# EasyEDA Pro project ProPrj_四轴3.0_2025-12-06.epro, board PCB1
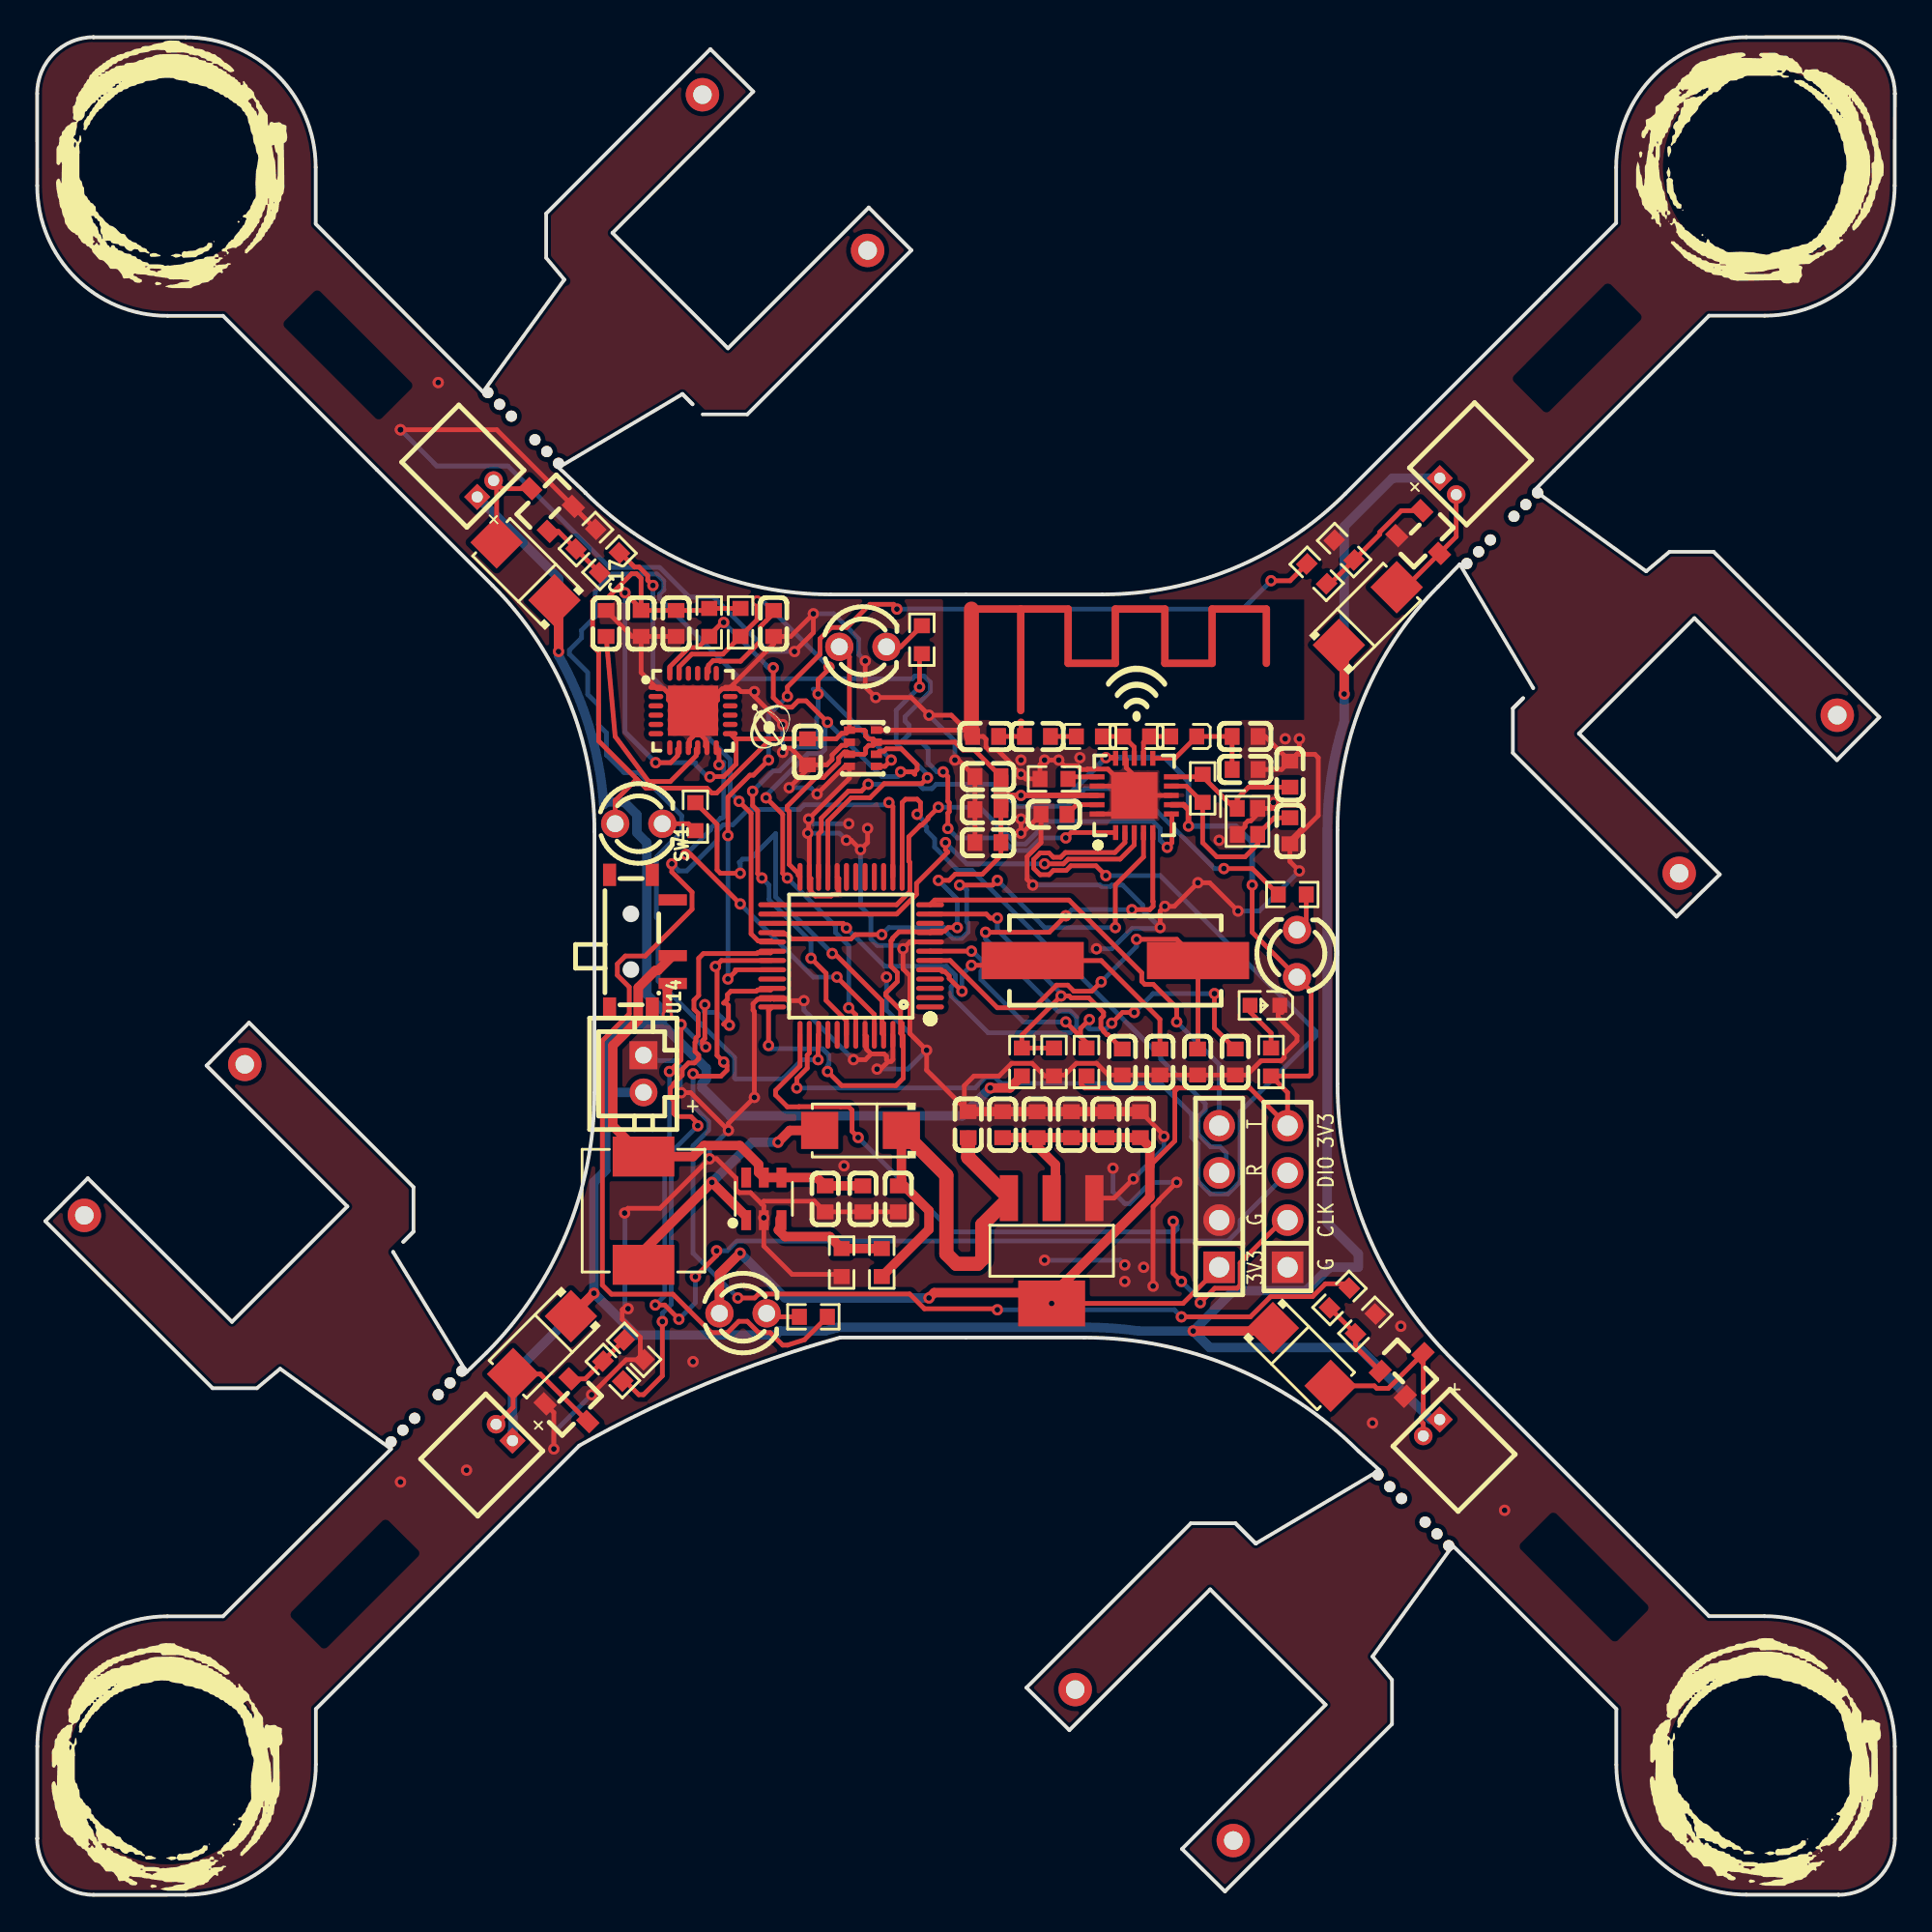
[diagram p14: board, top side]
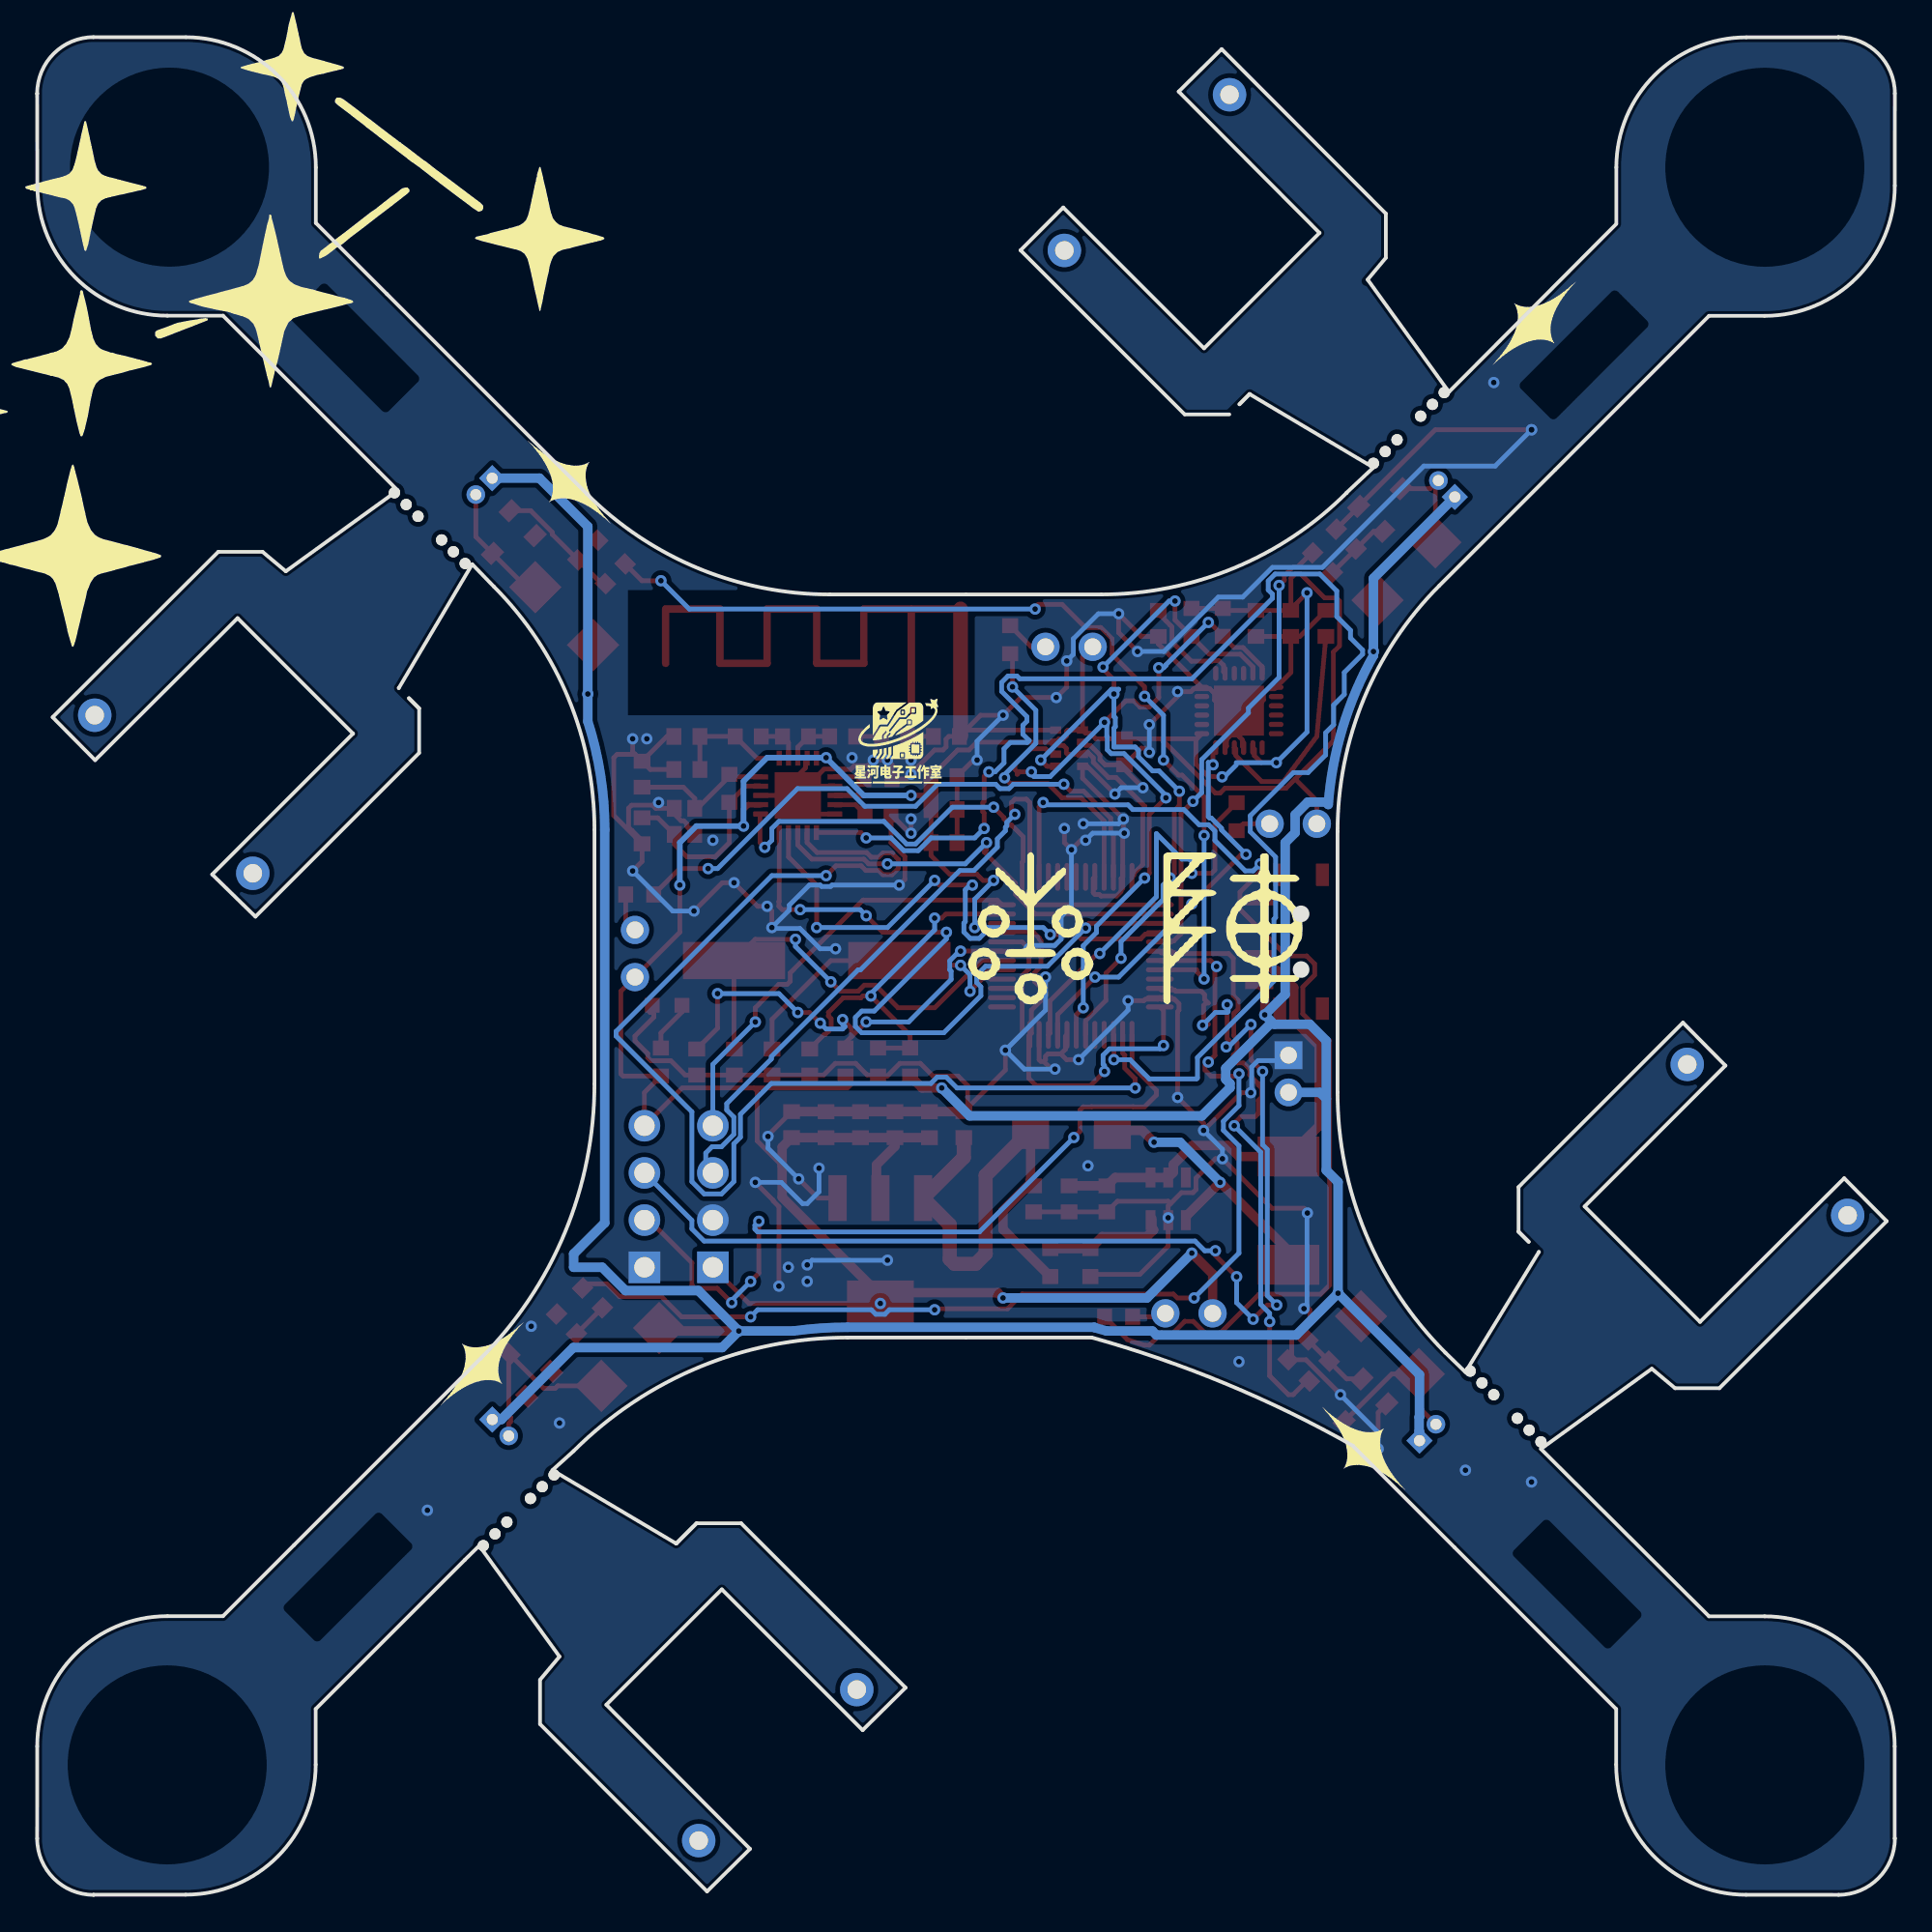
[diagram p15: board, bottom side, seen from below]

Outline 100 x 100 mm; copper layers: Top Layer, Bottom Layer. Coordinates in mm from the lower left corner of the outline.
Outline path: 0,3.04 0,3.04 arc(0.89,0.89) 3.04,0 8,0 arc(12.95,2.05) 15,7.01 15,10 23.71,18.71 29.18,24.19 arc(36.03,27.52) 43.22,30 56.37,30 arc(64.35,28.41) 71.12,23.89 72.26,22.86 65.6,18.91 ; 0.01,3.04 0.01,7.99 arc(2.06,12.94) 7.01,14.99 10,14.99 19.05,24 13.08,28.32 11.83,27.27 9.45,27.27 0.44,36.26 2.73,38.58 10.49,30.84 16.7,37.06 9.12,44.64 11.41,46.95 20.26,38.1 20.26,35.7 ; 3.04,100 3.04,100 arc(0.89,99.11) 0,96.96 0,92 arc(2.05,87.05) 7.01,85 10,85 18.29,76.71 24.52,70.48 arc(28.58,64.41) 30,57.24 30,43.2 arc(28.49,35.62) 24.19,29.18 23.11,28.14 19.16,34.61 19.16,34.6 ; 3.04,99.99 7.99,99.99 arc(12.94,97.94) 14.99,92.99 14.99,90 ; 14.99,89.94 24,80.9 28.38,86.95 27.4,88.12 27.4,90.5 36.24,99.36 38.55,97.07 30.97,89.46 37.18,83.25 44.77,90.83 47.06,88.53 38.23,79.69 35.83,79.69 ; 20.26,35.7 19.71,35.15 20.26,35.7 ; 34.72,80.79 34.73,80.79 ; 34.73,80.79 28.07,76.83 29.51,75.48 29.51,75.47 arc(35.57,71.42) 42.72,70 57.33,70 arc(64.42,71.41) 70.43,75.42 85,90 85,92.99 arc(87.05,97.95) 92,100 96.96,100 arc(99.11,99.11) 100,96.96 ; 34.73,80.79 35.28,80.24 34.73,80.79 ; 64.5,20 62.1,20 53.25,11.15 55.56,8.87 63.15,16.45 69.36,10.23 61.63,2.47 63.94,0.19 72.93,9.19 72.93,11.57 71.88,12.83 76.2,18.8 76.98,18.03 85.01,10 85.01,7.01 arc(87.06,2.06) 92.01,0.01 96.96,0.01 ; 64.5,20 65.6,18.91 ; 64.5,20 65.6,18.91 ; 65.6,18.91 65.61,18.91 ; 79.44,63.87 79.44,61.47 88.25,52.66 90.58,54.93 83,62.51 89.21,68.73 96.88,61.08 99.17,63.39 90.25,72.3 87.87,72.3 86.61,71.25 80.59,75.6 81.65,76.66 90,85.01 92.99,85.01 arc(97.94,87.06) 99.99,92.01 100,96.96 ; 79.44,63.87 79.99,64.41 79.44,63.87 ; 80.53,64.97 80.53,64.96 76.58,71.63 75.42,70.43 arc(71.41,64.42) 70,57.34 70,43.65 arc(71.59,35.66) 76.12,28.88 90,15 92.99,15 arc(97.95,12.95) 100,8 100,3.04 arc(99.11,0.89) 96.96,0 96.96,0 ; 100,96.96 100,96.96
Stack: Top Layer 0.035mm / Dielectric1 1.51mm FR4 er 4.5 / Bottom Layer 0.035mm

## Design rules (mm)
template: 自定义配置
spacing copperThickness1oz (default): track to track 0.102, other pairs 0.152 to 0.3
spacing copperThickness2oz: track to track 0.203, other pairs 0.152 to 0.3
track width copperThickness1oz (default): min 0.127, default 0.254, max 2.54
track width copperThickness2oz: min 0.203, default 0.254, max 2.54
differential pair differentialPair (default): width min 0.127, default 0.254, max 2.54; gap min 0.152, default 0.152
via viaSize (default): diameter min 0.5, default 0.61, max 10; hole min 0.3, default 0.305, max 6.3

## Placement (name value [footprint] x y rotation side)
C1  20pF  [C0603]  60.44 44.83 90 top
C2  100nF  [C0603]  51.97 41.46 270 top
C3  100nF  [C0603]  53.82 41.46 270 top
C4  100nF  [C0603]  55.68 41.46 270 top
C5  100nF  [C0603]  57.53 41.46 270 top
C6  10uF  [C0603]  46.36 37.47 90 top
C7  20pF  [C0603]  62.47 44.83 90 top
C8  10uF  [C0603]  42.42 37.47 90 top
C9  100nF  [C0603]  44.45 37.47 90 top
C10  100nF  [C0603]  64.49 44.83 90 top
C11  100nF  [C0603]  58.41 44.83 270 top
C12  10uF  [C0603]  50.12 41.46 90 top
C13  10uF  [C0603]  59.39 41.46 90 top
C14  2.2nF  [C0603]  39.64 68.44 90 top
C15  100nF  [C0603]  32.51 68.44 270 top
C16  10nF  [C0603]  34.39 68.44 90 top
C17  100nF  [C0603]  30.63 68.44 270 top
C35  100nF  [C0603]  41.47 61.53 90 top
C36  22pF  [C0603]  67.44 57.28 90 top
C37  22pF  [C0603]  67.44 60.33 270 top
C38  1.5pF  [C0603]  53.85 62.36 180 top
C39  1pF  [C0603]  51.05 62.36 0 top
C40  33nF  [C0603]  54.74 58.17 180 top
C41  100nF  [C0603]  51.18 58.42 0 top
C42  100nF  [C0603]  51.18 56.64 0 top
C43  1uF  [C0603]  51.18 60.2 0 top
C44  2.2nF  [C0603]  65.02 60.58 180 top
C45  4.7pF  [C0603]  65.02 62.36 180 top
CN2  1.25T-2AW  [CONN-TH_1.25T-2AW]  24.13 75.69 45 top
CN3  1.25T-2AW  [CONN-TH_1.25T-2AW]  25.15 24.89 135 top
CN4  1.25T-2AW  [CONN-TH_1.25T-2AW]  75.06 25.15 225 top
CN5  1.25T-2AW  [CONN-TH_1.25T-2AW]  75.95 75.82 315 top
D1  SS34  [SMA_L4.3-W2.6-LS5.2-RD]  44.32 41.15 180 top
D2  SS24  [SMA_L4.3-W2.6-LS5.2-RD]  26.29 71.25 135 top
D3  SS24  [SMA_L4.3-W2.6-LS5.2-RD]  27.18 29.59 225 top
D4  SS24  [SMA_L4.3-W2.6-LS5.2-RD]  68.07 28.96 315 top
D5  SS24  [SMA_L4.3-W2.6-LS5.2-RD]  71.63 68.83 45 top
H1  B-2100S04P-A110  [HDR-TH_4P-P2.54-V-M]  67.31 37.59 90 top
H2  B-2200S04P-A120  [HDR-TH_4P-P2.54-V-F]  63.63 37.59 90 top
L1  22uH  [IND-SMD_L7.1-W6.6]  32.64 36.83 270 top
L3  3.9nH  [L0603]  56.64 62.36 180 top
L4  8.2nH  [L0603]  59.18 62.36 0 top
L5  2.7nH  [L0603]  61.72 62.36 0 top
LED2  204-10SURD/S530-A3-L  [LED-TH_BD3.0-P2.54-FD]  38 31.3 0 top
LED3  204-10SURD/S530-A3-L  [LED-TH_BD3.0-P2.54-FD]  44.45 67.18 0 top
LED4  204-10SURD/S530-A3-L  [LED-TH_BD3.0-P2.54-FD]  67.82 50.67 90 top
LED5  204-10SURD/S530-A3-L  [LED-TH_BD3.0-P2.54-FD]  32.39 57.66 0 top
LED6  -  [LED_0603]  66.04 47.88 180 top
NOREF  -  [Pad_e2572]  88.39 54.99 135 top
NOREF#2  -  [Pad_e3071]  19.05 24.38 45 top
NOREF#3  -  [Pad_e3077]  76.96 71.67 45 top
NOREF#4  -  [Pad_e3079]  78.23 72.94 45 top
NOREF#5  -  [Pad_e2586]  2.54 36.58 135 top
NOREF#6  -  [Pad_e2895]  26.8 78.33 315 top
NOREF#7  -  [Pad_e2894]  25.53 79.6 315 top
NOREF#8  -  [Pad_e2882]  73.45 21.34 315 top
NOREF#9  -  [Pad_e3076]  22.86 28.19 45 top
NOREF#10  -  [Pad_e2897]  28.07 77.06 315 top
NOREF#11  -  [Pad_e3072]  19.69 25.02 45 top
NOREF#12  -  [Pad_e2883]  74.72 20.07 315 top
NOREF#13  -  [Pad_e3074]  21.59 26.92 45 top
NOREF#14  -  [Pad_e3081]  80.13 74.84 45 top
NOREF#15  -  [Pad_e2896]  27.43 77.69 315 top
NOREF#16  -  [Pad_e2893]  24.89 80.23 315 top
NOREF#17  -  [Pad_e2885]  75.99 18.8 315 top
NOREF#18  -  [Pad_e2584]  35.81 96.9 135 top
NOREF#19  -  [Pad_e2881]  72.81 21.97 315 top
NOREF#20  -  [Pad_e2583]  44.7 88.52 135 top
NOREF#21  -  [Pad_e2892]  24.26 80.87 315 top
NOREF#22  -  [Pad_e3080]  79.5 74.21 45 top
NOREF#23  -  [Pad_e2582]  96.9 63.5 135 top
NOREF#24  -  [Pad_e2587]  55.88 11.05 135 top
NOREF#25  -  [Pad_e2884]  75.35 19.43 315 top
NOREF#26  -  [Pad_e3082]  80.77 75.48 45 top
NOREF#27  -  [Pad_e2588]  64.39 2.92 135 top
NOREF#28  -  [Pad_e2880]  72.18 22.61 315 top
NOREF#29  -  [Pad_e3078]  77.59 72.3 45 top
NOREF#30  -  [Pad_e200]  52.96 63.12 180 top
NOREF#31  -  [Pad_e2585]  11.18 44.7 135 top
NOREF#32  -  [Pad_e3075]  22.23 27.56 45 top
NOREF#33  -  [Pad_e3073]  20.32 25.65 45 top
Q1  AO3400  [SOT-23_L2.9-W1.3-P1.90-LS2.4-BR]  27.38 74.88 315 top
Q2  AO3400  [SOT-23_L2.9-W1.3-P1.90-LS2.4-BR]  28.83 26.29 135 top
Q3  AO3400  [SOT-23_L2.9-W1.3-P1.90-LS2.4-BR]  73.79 28.32 225 top
Q4  AO3400  [SOT-23_L2.9-W1.3-P1.90-LS2.4-BR]  74.68 73.03 135 top
R1  9kΩ  [R0603]  45.47 34.04 90 top
R2  1kΩ  [R0603]  43.31 34.04 270 top
R3  10kΩ  [R0603]  56.49 44.83 270 top
R4  10kΩ  [R0603]  53.01 44.83 90 top
R5  10kΩ  [R0603]  54.74 44.83 270 top
R6  1kΩ  [R0603]  66.42 44.83 270 top
R7  10kΩ  [R0603]  37.86 68.5 90 top
R8  10kΩ  [R0603]  36.18 68.5 90 top
R9  1kΩ  [R0603]  41.78 31.11 180 top
R10  1kΩ  [R0603]  30.81 71.71 225 top
R11  10kΩ  [R0603]  29.54 72.98 225 top
R12  1kΩ  [R0603]  30.99 28.19 135 top
R13  10kΩ  [R0603]  32.13 29.34 135 top
R14  1kΩ  [R0603]  70.1 32.13 225 top
R15  10kΩ  [R0603]  71.5 30.73 225 top
R16  1kΩ  [R0603]  68.88 71.11 315 top
R17  10kΩ  [R0603]  70.36 72.39 315 top
R18  1kΩ  [R0603]  47.63 67.56 90 top
R19  1kΩ  [R0603]  67.56 53.85 0 top
R20  1kΩ  [R0603]  35.43 58.04 270 top
R41  22kΩ  [R0603]  54.74 60.07 180 top
R42  1MΩ  [R0603]  62.74 59.56 270 top
SW1  MSK12C02  [SW-TH_MSK12C02]  32.51 51.31 270 top
U1  STM32F103C8T6  [LQFP-48_L7.0-W7.0-P0.50-LS9.0-BL]  43.82 50.55 90 top
U2  8MHz  [CRYSTAL-SMD_L11.5-W4.8-LS12.7]  58.04 50.29 0 top
U3  MT3608  [SOT-23-6_L2.9-W1.6-P0.95-LS2.8-BL]  39.12 37.47 0 top
U4  AMS1117-3.3V  [SOT-223-4_L6.5-W3.5-P2.30-LS7.0-TR]  54.61 34.67 180 top
U5  MPU6050-YJLTY  [QFN-24_L4.0-W4.0-P0.50-BL-EP2.7]  35.31 63.75 270 top
U6  BMP280  [LGA-8_L2.5-W2.0-P0.65_AMP6127]  44.45 61.72 0 top
U13  NRF24L01P-R  [QFN-20_L4.0-W4.0-P0.50-BL-EP]  59.05 59.18 0 top
U14  PH2.0-2P  [CONN-TH_2P-P2.00_BOSSIE_BX-PH2.0-2PZZ]  32.64 44.2 270 top
X1  16MHz  [CRYSTAL-SMD_4P-L2.0-W1.6-BL]  65.15 57.78 270 top

## Footprints (pads in the part's own frame, mm; a bottom-side part is the same pattern mirrored in y, then rotated)
C0603
  rect 0.8x0.9 smd: 1(-0.7,0) 2(0.7,0)
CONN-TH_1.25T-2AW
  rect 1x1 hole 0.6: 1(-0.625,0)
  round 1 hole 0.6: 2(0.625,0)
CONN-TH_2P-P2.00_BOSSIE_BX-PH2.0-2PZZ
  rect 1.5x1.5 hole 0.9: 1(-1,0)
  round 1.5 hole 0.9: 2(1,0)
CRYSTAL-SMD_4P-L2.0-W1.6-BL
  rect 0.9x0.8 smd: 1(-0.7,-0.55) 2(0.7,-0.55) 3(0.7,0.55) 4(-0.7,0.55)
CRYSTAL-SMD_L11.5-W4.8-LS12.7
  rect 5.5x2 smd: 1(-4.45,0) 2(4.45,0)
HDR-TH_4P-P2.54-V-F
  rect 1.7x1.7 hole 1.1: 1(-3.81,0)
  round 1.7 hole 1.1: 2(-1.27,0) 3(1.27,0) 4(3.81,0)
HDR-TH_4P-P2.54-V-M
  rect 1.7x1.7 hole 1.1: 1(-3.81,0)
  round 1.7 hole 1.1: 2(-1.27,0) 3(1.27,0) 4(3.81,0)
IND-SMD_L7.1-W6.6
  rect 2.15x3.32 smd: 1(-2.913,0) 2(2.913,0)
L0603
  rect 0.8x0.864 smd: 1(-0.7,0) 2(0.7,0)
LED-TH_BD3.0-P2.54-FD
  round 1.524 hole 0.914: 1(-1.27,0) 2(1.27,0)
LED_0603
  rect 0.8x0.8 smd: 1(-0.851,-0.01) 2(0.75,-0.005)
LGA-8_L2.5-W2.0-P0.65_AMP6127
  rect 0.6x0.4 smd: 1(0.725,0.975) 2(0.725,0.325) 3(0.725,-0.325) 4(0.725,-0.975) 5(-0.725,-0.975) 6(-0.725,-0.325) 7(-0.725,0.325) 8(-0.725,0.975)
LQFP-48_L7.0-W7.0-P0.50-LS9.0-BL
  oval 0.27x1.5 smd: 1(-2.75,-4.25) 2(-2.25,-4.25) 3(-1.75,-4.25) 4(-1.25,-4.25) 5(-0.75,-4.25) 6(-0.25,-4.25) 7(0.25,-4.25) 8(0.75,-4.25) 9(1.25,-4.25) 10(1.75,-4.25) 11(2.25,-4.25) 12(2.75,-4.25) 25(2.75,4.25) 26(2.25,4.25) 27(1.75,4.25) 28(1.25,4.25) 29(0.75,4.25) 30(0.25,4.25) 31(-0.25,4.25) 32(-0.75,4.25) 33(-1.25,4.25) 34(-1.75,4.25) 35(-2.25,4.25) 36(-2.75,4.25)
  oval 1.5x0.27 smd: 13(4.25,-2.75) 14(4.25,-2.25) 15(4.25,-1.75) 16(4.25,-1.25) 17(4.25,-0.75) 18(4.25,-0.25) 19(4.25,0.25) 20(4.25,0.75) 21(4.25,1.25) 22(4.25,1.75) 23(4.25,2.25) 24(4.25,2.75) 37(-4.25,2.75) 38(-4.25,2.25) 39(-4.25,1.75) 40(-4.25,1.25) 41(-4.25,0.75) 42(-4.25,0.25) 43(-4.25,-0.25) 44(-4.25,-0.75) 45(-4.25,-1.25) 46(-4.25,-1.75) 47(-4.25,-2.25) 48(-4.25,-2.75)
Pad_e200
  round 0.4 smd: 2(0,0)
Pad_e2572
  round 1.8 hole 1: 1(0,0)
Pad_e2582
  round 1.8 hole 1: 1(0,0)
Pad_e2583
  round 1.8 hole 1: 1(0,0)
Pad_e2584
  round 1.8 hole 1: 1(0,0)
Pad_e2585
  round 1.8 hole 1: 1(0,0)
Pad_e2586
  round 1.8 hole 1: 1(0,0)
Pad_e2587
  round 1.8 hole 1: 1(0,0)
Pad_e2588
  round 1.8 hole 1: 1(0,0)
Pad_e2880
  round 0.6 hole 0.6: 1(0,0)
Pad_e2881
  round 0.6 hole 0.6: 1(0,0)
Pad_e2882
  round 0.6 hole 0.6: 1(0,0)
Pad_e2883
  round 0.6 hole 0.6: 1(0,0)
Pad_e2884
  round 0.6 hole 0.6: 1(0,0)
Pad_e2885
  round 0.6 hole 0.6: 1(0,0)
Pad_e2892
  round 0.6 hole 0.6: 1(0,0)
Pad_e2893
  round 0.6 hole 0.6: 1(0,0)
Pad_e2894
  round 0.6 hole 0.6: 1(0,0)
Pad_e2895
  round 0.6 hole 0.6: 1(0,0)
Pad_e2896
  round 0.6 hole 0.6: 1(0,0)
Pad_e2897
  round 0.6 hole 0.6: 1(0,0)
Pad_e3071
  round 0.6 hole 0.6: 1(0,0)
Pad_e3072
  round 0.6 hole 0.6: 1(0,0)
Pad_e3073
  round 0.6 hole 0.6: 1(0,0)
Pad_e3074
  round 0.6 hole 0.6: 1(0,0)
Pad_e3075
  round 0.6 hole 0.6: 1(0,0)
Pad_e3076
  round 0.6 hole 0.6: 1(0,0)
Pad_e3077
  round 0.6 hole 0.6: 1(0,0)
Pad_e3078
  round 0.6 hole 0.6: 1(0,0)
Pad_e3079
  round 0.6 hole 0.6: 1(0,0)
Pad_e3080
  round 0.6 hole 0.6: 1(0,0)
Pad_e3081
  round 0.6 hole 0.6: 1(0,0)
Pad_e3082
  round 0.6 hole 0.6: 1(0,0)
QFN-20_L4.0-W4.0-P0.50-BL-EP
  rect 0.28x0.8 smd: 1(-1,-2) 2(-0.5,-2) 3(0,-2) 4(0.5,-2) 5(1,-2) 11(1,2) 12(0.5,2) 13(0,2) 14(-0.5,2) 15(-1,2)
  rect 0.8x0.28 smd: 6(2,-1) 7(2,-0.5) 8(2,0) 9(2,0.5) 10(2,1) 16(-2,1) 17(-2,0.5) 18(-2,0) 19(-2,-0.5) 20(-2,-1)
  rect 2.5x2.5 smd: 21(0,0)
QFN-24_L4.0-W4.0-P0.50-BL-EP2.7
  oval 0.28x0.8 smd: 1(-1.25,-2) 2(-0.75,-2) 3(-0.25,-2) 4(0.25,-2) 5(0.75,-2) 6(1.25,-2) 13(1.25,2) 14(0.75,2) 15(0.25,2) 16(-0.25,2) 17(-0.75,2) 18(-1.242,2)
  oval 0.8x0.28 smd: 7(2,-1.25) 8(2,-0.75) 9(2,-0.25) 10(2,0.25) 11(2,0.75) 12(2,1.25) 19(-2,1.25) 20(-2,0.75) 21(-2,0.25) 22(-2,-0.25) 23(-2,-0.75) 24(-2,-1.25)
  rect 2.7x2.7 smd: 25(0.013,0)
R0603
  rect 0.806x0.864 smd: 1(-0.753,0) 2(0.753,0)
SMA_L4.3-W2.6-LS5.2-RD
  rect 2x2 smd: 1(-2.2,0) 2(2.2,0)
SOT-23-6_L2.9-W1.6-P0.95-LS2.8-BL
  rect 0.532x1.072 smd: 1(-0.95,-1.149) 2(0,-1.149) 3(0.95,-1.149) 4(0.95,1.149) 5(0,1.149) 6(-0.95,1.149)
SOT-23_L2.9-W1.3-P1.90-LS2.4-BR
  rect 1x0.8 smd: 1(1.15,-0.95) 2(1.15,0.95) 3(-1.15,0)
SOT-223-4_L6.5-W3.5-P2.30-LS7.0-TR
  rect 0.98x2.47 smd: 1(-2.3,-2.835) 2(0,-2.835) 3(2.3,-2.835)
  rect 3.6x2.47 smd: 4(0,2.835)
SW-TH_MSK12C02
  rect 0.6x1.524 smd: 1(-2.25,1.7) 2(0.75,1.7) 3(2.25,1.7)
  rect 1.2x0.7 smd: 4(-3.6,0.6) 4(-3.6,-1.7) 4(3.6,0.6) 4(3.6,-1.7)

## Nets
3V3: C2.2 C3.2 C4.2 C5.2 C13.1 C15.1 C16.2 C35.2 C41.2 C42.2 C43.2 H1.4 H2.1 LED2.1 LED3.1 LED4.1 LED5.1 R3.2 R6.2 R7.2 R8.2 U1.9 U1.24 U1.36 U1.48 U4.2 U4.4 U5.8 U5.13 U6.2 U6.6 U6.8 U13.7 U13.15 U13.18
5V: C6.2 C12.1 D1.1 R1.1 U4.3
GND: C1.1 C2.1 C3.1 C4.1 C5.1 C6.1 C7.1 C8.1 C9.1 C10.1 C11.2 C12.2 C13.2 C14.1 C15.2 C16.1 C17.1 C35.1 C36.1 C37.1 C39.1 C40.2 C41.1 C42.1 C43.1 C44.1 C45.1 H1.1 H2.2 LED6.1 Q1.2 Q2.2 Q3.2 Q4.2 R2.2 R5.2 R11.1 R13.1 R15.1 R17.1 R41.2 U1.8 U1.20 U1.23 U1.35 U1.44 U1.47 U3.2 U4.1 U5.1 U5.9 U5.11 U5.18 U5.25 U6.1 U6.5 U6.7 U13.8 U13.14 U13.17 U13.20 U13.21 U14.1 X1.2 X1.4
$1I18711\$1N4: L3.1 L4.1 U13.13
$1I18711\$1N5: L4.2 L5.1 U13.12
$1I18711\$1N6: C44.2 C45.2 L5.2 U13.11
$1I18711\$1N7: C36.2 R42.2 U13.9 X1.3
$1I18711\$1N8: C37.2 R42.1 U13.10 X1.1
$1I18711\$1N462: R41.1 U13.16
$1I18711\$1N465: C40.1 U13.19
$1I18711\$1N472: C38.1 L3.2
$1I18711\$1N473: C38.2 C39.2 NOREF#30.2
$1I21843\$1N581: C17.2 U5.10
$1I21843\$1N587: C14.2 U5.20
$1I25803\$1N551: D1.2 L1.2 U3.1
$1I25803\$1N553: R1.2 R2.1 U3.3
BAT: CN2.1 CN3.1 CN4.1 CN5.1 D2.1 D3.1 D4.1 D5.1 R4.1 SW1.3 U14.2
C: NOREF.1
CE: U1.39 U13.1
CH1: R10.1 U1.29
CH2: R12.1 U1.30
CH3: R14.1 U1.31
CH4: R16.1 U1.32
CSN: U1.38 U13.2
INT: U1.45 U5.12
IRQ: U1.25 U13.6
MISO: U1.27 U13.5
MOSI: U1.28 U13.4
PA1: C11.1 R4.2 R5.1 U1.11
PA4: R9.1 U1.14
PB9: R20.1 U1.46
PB10: R18.1 U1.21
PB11: R19.1 U1.22
RESET: C10.2 R3.1 U1.7
SCK: U1.26 U13.3
SCL: R7.1 U1.42 U5.23 U6.4
SDA: R8.1 U1.43 U5.24 U6.3
SWCLK(PA14): H1.2 U1.37
SWDIO(PA13): H1.3 U1.34
UART2_RX: H2.3 U1.13
UART2_TX: H2.4 U1.12
$1N5880: Q3.1 R14.2 R15.2
$1N5885: Q2.1 R12.2 R13.2
$1N5890: Q1.1 R10.2 R11.2
$1N5900: LED6.2 R6.1
$1N5903: C7.2 U1.6 U2.2
$1N5904: C1.2 U1.5 U2.1
$1N5960: CN2.2 D2.2 Q1.3
$1N5961: CN4.2 D4.2 Q3.3
$1N5962: CN3.2 D3.2 Q2.3
$1N5973: LED2.2 R9.2
$1N5974: LED3.2 R18.2
$1N5975: LED4.2 R19.2
$1N5976: LED5.2 R20.2
$1N6000: C8.2 C9.2 L1.1 SW1.2 U3.4 U3.5
$1N6034: CN5.2 D5.2 Q4.3
$1N6037: Q4.1 R16.2 R17.2

Pads without a net: NOREF#2 1; NOREF#3 1; NOREF#4 1; NOREF#5 1; NOREF#6 1; NOREF#7 1; NOREF#8 1; NOREF#9 1; NOREF#10 1; NOREF#11 1; NOREF#12 1; NOREF#13 1; NOREF#14 1; NOREF#15 1; NOREF#16 1; NOREF#17 1; NOREF#18 1; NOREF#19 1; NOREF#20 1; NOREF#21 1; NOREF#22 1; NOREF#23 1; NOREF#24 1; NOREF#25 1; NOREF#26 1; NOREF#27 1; NOREF#28 1; NOREF#29 1; NOREF#31 1; NOREF#32 1; NOREF#33 1; SW1 1 4; U1 1 2 3 4 10 15 16 17 18 19 33 40 41; U3 6; U5 2 3 4 5 6 7 14 15 16 17 19 21 22

## Via types
v1: diameter 0.61, hole 0.305, Top Layer to Bottom Layer, 178 vias

## Routing (per net, layer and track width the routed paths; a pad name or vN(x,y) marks a point on that pad's centre or on a via; arc(x,y) is an arc through that point)
3V3: length 231.3
  Top Layer w0.254: 32.28,60.06 32.77,59.57 36.06,59.57 36.32,59.31 36.58,59.31 39.5,62.23 ; 32.28,60.06 31.12,58.9 LED5.1 ; 32.28,60.06 30.23,62.11 30.23,66.9 29.9,67.22 29.9,69.66 30.06,69.82 30.7,69.82 32,71.12 32.26,71.12 32.51,70.87 32.51,69.22 ; U6.8 43.73,66.64 LED3.1 ; U6.8 44.52,62.7 44.6,62.63 44.6,62.38 44.76,62.22 45,62.22 U6.2 ; U6.8 43.55,62.53 43.31,62.53 43.01,62.23 C35.2 39.5,62.23 ; v1(33.29,60.95) 34.1,60.95 34.48,61.32 34.48,61.67 U5.8 ; v1(65.41,54.36) 65.41,51.82 LED4.1 68.58,48.64 68.58,44.2 68.46,44.08 R6.2 67.31,43.19 H1.4 65.28,43.43 61.41,43.43 ; v1(49.53,52.07) 49.04,52.07 48.85,51.88 48.15,51.88 U1.9 48.02,51.84 46.39,51.84 46.05,51.5 46.05,51.45 45.96,51.36 45.96,49.99 46.3,49.64 46.3,49.16 45.68,48.53 45.68,48.43 46.48,47.62 46.48,46.38 U1.48 46.62,46.24 46.62,43.96 46.23,43.56 43.31,43.56 v1(42.55,44.32) ; U6.2 45,61.88 44.76,61.88 44.6,61.71 44.6,61.47 44.52,61.4 U6.6 43.6,61.52 43.46,61.52 43.15,61.21 43.15,60.96 42.33,60.15 41.93,60.15 40.37,58.6 40.37,58.42 40.49,58.31 40.49,55.46 40.97,54.98 40.97,54.89 U1.24 ; U6.2 49.42,62.05 49.84,61.63 50.45,61.63 C43.2 ; R7.2 R8.2 36.07,69.14 C16.2 ; 39.5,62.23 37.58,62.23 ; v1(39.37,45.72) 39.37,47.6 U1.36 ; R3.2 56.42,44.08 56.21,43.87 56.21,43.61 56.39,43.43 61.41,43.43 ; H2.1 61.68,31.84 v1(54.61,31.84) ; v1(36.22,60.18) 36.96,60.2 37.63,60.87 37.63,62.18 37.58,62.23 ; 32.51,69.22 C15.1 34.39,69.14 ; 32.51,69.22 v1(31.64,70.09) ; 61.41,43.43 61.24,43.26 61.24,40.58 59.9,39.24 ; 37.58,62.23 U5.13 ; v1(48.51,54.61) 49.08,54.61 49.42,54.94 50.88,54.94 51.88,55.94 C42.2 C41.2
  Top Layer w0.3: v1(57.53,61.21) 58.05,61.21 58.05,61.18 ; 51.88,59.18 v1(52.96,59.18) 57.06,59.18 ; v1(61.98,57.53) 61.98,58.42 61.71,58.68 61.05,58.68
  Top Layer w0.508: LED2.1 36.73,33.43 v1(37.85,34.54) ; v1(54.61,31.84) 54.03,32.42 48.29,32.42 v1(48.01,32.13) ; U4.2 54.82,37.71 54.82,39.3 53.82,40.29 C3.2 ; 55.12,32.78 59.9,37.56 59.9,40.25 C13.1 51.97,40.76 C2.2
  Top Layer w0.8: C43.2 C41.2
  Bottom Layer w0.254: 35.45,60.95 v1(33.29,60.95) 31.64,62.6 v1(31.64,70.09) ; 36.22,60.06 35.45,60.82 ; v1(39.37,45.72) 39.55,45.54 42.28,45.54 42.62,45.2 42.62,44.72 42.55,44.64 v1(42.55,44.32) ; v1(49.53,52.07) 49.53,53.59 v1(48.51,54.61)
  Bottom Layer w0.3: v1(65.41,54.36) 65.41,56.64 64.52,57.53 v1(61.98,57.53) 61.98,59.94 60.71,61.21 v1(57.53,61.21) 55.5,59.18 v1(52.96,59.18)
  Bottom Layer w0.508: v1(48.01,32.13) 40.26,32.13 v1(37.85,34.54)
5V: length 27.8
  Top Layer w0.508: D1.1 46.52,38.33 C6.2 46.67,38.17 48.01,36.83 48.01,35.82 R1.1
  Top Layer w0.762: D1.1 48.94,38.73 48.94,34.51 49.48,33.97 50.62,33.97 50.88,34.22 50.88,36.07 U4.3 50.12,39.7 C12.1
GND: length 388.7
  Top Layer w0.254: C36.1 67.44,56.75 67.99,57.3 68,57.3 68.17,57.46 68.17,58.49 68,58.66 66.87,58.66 66.7,58.48 X1.4 65.7,58.19 65.33,57.81 65.19,57.81 65.02,57.65 65.02,57.51 X1.2 ; C36.1 68.96,58.1 68.96,61.21 68.78,61.39 67.81,61.39 ; C36.1 67.44,55.63 v1(67.95,55.12) ; C44.1 66.99,60.58 C37.1 ; C35.1 40.58,61.72 40.35,61.72 v1(40.13,61.5) ; C35.1 42.51,60.83 42.79,61.11 42.79,61.36 43.31,61.88 43.55,61.88 U6.7 ; C35.1 41.47,60.58 v1(40.48,59.6) ; 50.01,62.7 50.35,62.36 50.93,62.36 51.08,62.21 51.08,61.79 51.24,61.63 51.7,61.63 52.56,60.76 52.56,60.72 v1(52.96,60.33) 53.21,60.07 R41.2 53.98,60.84 v1(54.23,61.09) v1(54.99,61.09) 55.3,60.78 56.01,60.78 56.21,60.58 56.52,60.58 56.54,60.6 57.64,60.6 58.55,59.68 ; 50.01,62.7 49.21,63.5 v1(48.01,63.5) 47.05,64.45 v1(45.14,64.45) 44.58,65.02 v1(44.58,66.42) ; 50.01,62.7 U6.1 ; U13.14 58.64,61.1 58.64,60.67 59.05,60.25 U13.21 ; v1(64.64,52.96) 63.12,54.48 v1(62.48,54.48) 61.21,53.21 v1(60.71,53.21) 60.45,52.96 v1(60.45,52.07) ; U5.18 37.23,64.92 36.87,64.92 36.63,64.68 36.63,64.32 36.05,63.74 U5.25 34.57,63.74 33.98,64.33 33.98,64.68 33.74,64.92 33.39,64.92 U5.1 32.51,65.8 C15.2 ; U5.18 39.64,67.33 C14.1 40.56,67.74 v1(41.78,68.96) 41.78,67.94 v1(40.77,66.93) ; U5.18 37.38,64.92 37.74,64.92 37.89,64.77 v1(38.61,64.77) 38.61,64.52 v1(40.13,62.99) ; 44.89,45.27 44.58,44.96 v1(43.94,44.96) ; 44.89,45.27 45.59,45.27 45.72,45.14 45.72,44.96 45.82,44.86 ; 44.89,45.27 44.65,45.51 44.65,46.21 U1.44 ; 67.81,61.39 67.95,61.53 v1(67.95,62.23) ; 67.81,61.39 C37.1 ; v1(31.81,31.55) 31.55,31.55 31.5,31.5 31.5,30.98 32.47,30.01 32.47,29 R13.1 31.7,28.8 30.05,27.16 30.05,27.13 v1(29.84,26.92) ; C15.2 32.03,67.74 C17.1 ; C15.2 C16.1 ; 38.99,37.21 38.4,37.8 37.78,37.8 37.62,37.96 37.62,38.58 36.58,39.62 v1(36.2,39.62) 33.53,36.96 31.8,36.96 31.62,36.78 v1(31.62,36.7) ; 38.99,37.21 39.12,37.34 41.85,37.34 C8.1 C9.1 C6.1 ; 38.99,37.21 39.12,37.08 U3.2 39.12,34.92 40.64,33.4 43.19,33.4 R2.2 ; v1(44.7,57.4) 44.7,56.64 v1(44.32,56.26) 43.82,56.77 v1(43.56,56.77) ; U1.47 46.07,44.96 45.97,44.86 45.82,44.86 ; 58.55,59.68 U13.17 ; 58.55,59.68 U13.21 ; 45.82,44.86 45.41,44.45 v1(45.21,44.45) ; U1.8 46.98,51.3 v1(46.61,50.93) 46.61,49.84 46.98,49.47 46.98,46.37 v1(47.88,45.47) 47.88,44.4 49.91,42.37 ; v1(34.67,43.18) 35.18,43.18 v1(37.21,41.15) 37.21,41.53 v1(38.61,42.93) 38.61,47.55 38.54,47.62 38.54,47.97 38.78,48.21 39.48,48.21 U1.35 39.65,48.21 40.35,48.21 40.43,48.13 v1(41.27,48.13) ; v1(59.01,38.54) 57.97,37.51 U4.1 ; v1(19.56,78.87) 24.74,78.87 28.86,74.74 28.86,74.72 R11.1 ; U13.21 58.05,58.18 U13.20 ; U13.21 U13.8 ; 49.91,42.37 C12.2 ; 49.91,42.37 49.91,43.56 50.43,44.08 51.78,44.08 52.46,44.76 53.56,44.76 54.24,44.08 R5.2 54.79,44.13 55.31,44.13 55.94,44.76 57.03,44.76 57.66,44.13 C11.2 C1.1 C7.1 C10.1 65.12,44.13 65.89,44.9 66.97,44.9 67.13,45.07 67.13,45.29 67.82,45.97 67.82,46.23 66.8,47.24 66.8,47.41 66.89,47.5 67.02,47.5 ; v1(49.4,61.09) 49.59,61.09 C43.1 C41.1 C42.1 ; v1(60.66,40.83) 60.66,40.89 C13.2 ; C37.1 66.11,62.36 C45.1 ; U1.20 43.15,54.71 43.15,53.95 43.05,53.85 42.82,53.85 42.74,53.77 41.89,53.77 41.65,54.01 41.65,54.71 U1.23 41.57,57.07 v1(41.48,57.15) 41.53,57.2 v1(41.53,57.91) 43.73,60.11 U6.5 43.47,60.75 v1(41.98,59.26) ; v1(60.07,32.77) 60.07,37.05 60.38,37.36 60.38,37.39 v1(61.34,38.35) ; v1(27.81,24) 27.81,25.96 Q2.2 ; U5.11 35.98,61.83 35.98,62.19 35.73,62.43 35.38,62.43 35.31,62.5 35.31,62.36 35.12,62.17 35.12,61.82 U5.9 ; v1(53.59,54.36) 53.29,54.66 53.29,55.89 54.04,56.64 C40.2 53.02,57.15 v1(52.96,57.15) v1(52.96,57.91)
  Top Layer w0.4: 50.29,69.22 52.95,69.22 ; 52.95,69.22 52.95,63.75 ; 52.95,69.22 55.5,69.22 55.5,66.29 58.04,66.29 58.04,69.22 60.71,69.22 60.71,66.29 63.25,66.29 63.25,69.22 66.17,69.22 66.17,66.29
  Top Layer w0.508: C12.2 C13.2
  Top Layer w0.8: 50.29,62.36 50.29,69.22
  Bottom Layer w0.254: v1(41.48,57.15) 43.18,57.15 v1(43.56,56.77) ; v1(44.58,66.42) 44.22,66.78 44.22,67.61 42.87,68.96 v1(41.78,68.96) ; v1(48.01,63.5) 49.4,62.1 v1(49.4,61.09) ; v1(45.72,49.4) 45.72,47.62 v1(47.88,45.47) 46.86,44.45 v1(45.21,44.45) ; v1(46.61,50.93) 46.43,51.11 45.22,51.11 44.88,51.45 44.88,52.65 44.32,53.21 v1(44.32,56.26) ; v1(61.34,38.35) 59.94,38.35 58.8,37.21 58.55,37.21 57.91,37.85 v1(57.91,39.12) ; v1(37.21,41.15) 36.2,40.13 v1(36.2,39.62) ; v1(29.84,26.92) 27.81,24.89 v1(27.81,24) ; v1(60.66,40.83) 60.66,40.19 v1(59.01,38.54) ; v1(64.64,52.96) 65.79,52.96 v1(67.95,55.12) ; v1(19.56,78.87) 21.51,76.91 25.36,76.91 30.81,71.46 33.5,71.46 35.1,69.86 36.42,69.86 39.35,66.93 v1(40.77,66.93) ; v1(41.98,59.26) 41.65,59.6 v1(40.48,59.6) ; v1(31.62,36.7) 31.64,36.68 31.64,31.72 v1(31.81,31.55) ; v1(43.94,44.96) 41.27,47.62 v1(41.27,48.13) ; v1(41.53,57.91) 41.78,57.66 v1(43.69,57.66) ; U14.1 32.93,44.91 34.28,44.91 34.62,44.56 34.62,43.22 34.66,43.18 v1(34.67,43.18) ; v1(53.59,54.36) 57.21,54.36 57.29,54.28 57.77,54.28 57.85,54.36 58.43,54.36 59.51,53.28 59.51,53.01 v1(60.45,52.07) 60.4,52.02 58.94,52.02 57.85,50.93 v1(57.02,50.93) ; v1(40.13,61.5) v1(40.13,62.99) ; v1(54.23,34.16) 58.29,34.16 v1(58.55,33.91)
  vias: v1(19.56,22.22) v1(21.59,81.41) v1(23.11,22.86) v1(35.31,28.7) v1(39.12,36.45) v1(43.43,39.24) v1(52.96,61.09) v1(56.13,61.21) v1(58.55,33.02) v1(59.56,33.78) v1(63.63,56.77) v1(66.55,58.8) v1(67.18,62.23) v1(71.88,25.4) v1(73.41,30.61) v1(78.99,20.7)
$1I18711\$1N4: length 2.6
  Top Layer w0.254: 57.34,62.36 L4.1 59.05,61.78 59.05,61.18
$1I18711\$1N5: length 2.4
  Top Layer w0.254: L5.1 59.88,62.36 59.56,62.03 59.56,61.18
$1I18711\$1N6: length 6.5
  Top Layer w0.254: 64.32,60.58 64.32,62.36 62.42,62.36 61.25,61.18 60.06,61.18
$1I18711\$1N7: length 10.4
  Top Layer w0.254: 61.05,59.68 61.86,59.68 62.73,58.81 62.74,58.81 62.74,56.64 63.5,55.88 65.02,55.88 65.7,56.56 X1.3 66.59,57.98 67.44,57.98
$1I18711\$1N8: length 8
  Top Layer w0.254: 61.05,60.18 62.6,60.18 62.74,60.32 62.74,60.2 64.45,58.49 64.6,58.49 64.6,59.01 65.21,59.62 C37.2
$1I18711\$1N462: length 1.6
  Top Layer w0.254: R41.1 55.6,60.18 57.06,60.18
$1I18711\$1N465: length 1.8
  Top Layer w0.254: 57.06,58.68 55.95,58.68 C40.1
$1I18711\$1N472: length 1.4
  Top Layer w0.254: 54.55,62.36 55.94,62.36
$1I18711\$1N473: length 2.2
  Top Layer w0.254: NOREF#30.2 52.96,62.36 ; 52.96,62.36 51.76,62.36 ; 52.96,62.36 53.15,62.36
$1I21843\$1N581: length 12
  Top Layer w0.254: C17.2 31.12,62.36 32.91,59.93 34.08,59.93 35.48,61.32 35.48,61.67 U5.10
$1I21843\$1N587: length 5.8
  Top Layer w0.254: 39.22,68.56 39.64,68.98 C14.2 ; U5.20 36.14,65.83 36.14,66.19 36.38,66.43 36.73,66.43 36.76,66.41 37.87,66.41 38.92,67.46 38.92,68.25 39.02,68.36 39.22,68.56
$1I25803\$1N551: length 15.7
  Top Layer w0.508: D1.2 40.51,41.15 v1(39.88,40.51) ; U3.1 38.17,36.51 v1(36.32,38.35) 32.64,34.67 L1.2
  Bottom Layer w0.508: v1(39.88,40.51) 38.48,40.51 v1(36.32,38.35)
$1I25803\$1N553: length 6.6
  Top Layer w0.508: R1.2 R2.1 42.66,35.43 40.26,35.43 39.9,35.79 39.99,35.88 39.99,36.39
BAT: length 204.5
  Top Layer w0.508: D4.1 66.36,30.35 v1(62.23,30.35) ; v1(51.31,43.43) 52.36,43.43 R4.1 ; v1(28.07,66.93) 28.07,69.47 D2.1 ; D3.1 v1(29.97,32.39) ; SW1.3 33.92,48.77 v1(33.92,47.37) ; D5.1 70.36,66.99 v1(70.36,64.64)
  Bottom Layer w0.508: CN5.1 72.96,76.26 70.36,73.66 v1(70.36,64.64) 70.36,63.17 arc(69.68,60.29) 69.45,57.34 69.45,36.17 71.12,34.5 71.12,33.78 69.58,33.78 68.33,32.53 64.4,32.53 v1(62.23,30.35) ; v1(51.31,43.43) 49.81,41.93 37.31,41.93 35.79,43.45 35.79,43.67 36.02,43.9 36.02,44.49 33.71,46.79 ; v1(29.97,32.39) 29.97,38.37 30.61,39 30.61,42.86 ; v1(29.97,32.39) 25.59,28 25.59,25.73 25.61,25.71 25.61,24.96 25.59,24.94 25.59,24.45 ; v1(29.97,32.39) 32.22,30.14 39.75,30.14 39.97,30.35 42.44,30.35 arc(42.75,30.44) 43.07,30.53 43.09,30.55 56.37,30.55 arc(57.83,30.5) 59.29,30.35 v1(62.23,30.35) ; 30.61,42.86 30.95,43.2 U14.2 ; 30.61,42.86 30.61,45.97 31.5,46.86 33.41,46.86 v1(33.92,47.37) 32.82,48.47 32.82,56.64 32.28,57.17 32.28,58.14 31.6,58.83 30.63,58.83 30.5,58.69 arc(29.72,62.84) 28.07,66.71 v1(28.07,66.93) 28.07,70.87 CN2.1 ; v1(62.23,30.35) 63.12,29.46 71.14,29.46 75.01,25.59 CN4.1
CE: length 80.6
  Top Layer w0.254: v1(55.37,56.9) 55.66,57.18 U13.1 ; v1(42.04,44.96) 42.04,46.27 U1.39 ; v1(48.77,60.45) 49.02,60.2 49.02,58.86 49.1,58.79 49.1,58.31 49.02,58.23 v1(49.02,57.4)
  Bottom Layer w0.254: v1(49.02,57.4) 49.53,56.9 51.88,56.9 52.57,56.21 53.35,56.21 54.03,56.9 v1(55.37,56.9) ; v1(42.04,44.96) 41.17,44.96 40.13,43.92 37.59,43.92 37.54,43.97 37.54,45.07 33.42,49.19 33.42,52.52 33.33,52.61 33.33,55.86 34.7,57.23 34.7,58.09 32.37,60.41 31.59,60.41 30.64,61.36 30.64,62.55 30.21,62.98 30.21,64.04 29.64,64.62 29.64,65.8 28.65,66.79 28.65,67.01 29.3,67.66 29.3,68.07 30.04,68.81 30.04,70.19 30.96,71.1 33.36,71.1 33.73,70.73 33.73,70.24 33.5,70.02 33.5,69.79 37.83,65.46 47.11,65.46 47.26,65.61 47.74,65.61 48.08,65.27 48.08,64.78 46.72,63.42 46.72,63.18 46.94,62.96 46.94,62.48 46.6,62.14 46.7,62.03 47.61,62.03 47.95,61.69 47.95,60.93 48.43,60.45 v1(48.77,60.45)
CH1: length 24.9
  Top Layer w0.254: R10.1 31.39,72.24 32.16,71.48 32.41,71.48 32.87,71.02 32.87,70.77 v1(33.15,70.48) ; U1.29 39.51,51.35 38.81,51.35 38.43,51.73 38.43,58.22 v1(37.78,58.86)
  Bottom Layer w0.254: v1(37.78,58.86) 37.31,59.33 37.31,61.11 34.8,63.62 34.8,63.88 33.15,65.53 v1(33.15,70.48)
CH2: length 32.5
  Top Layer w0.254: U1.30 39.48,50.71 38.78,50.71 38.74,50.67 35.86,50.67 35.61,50.42 35.61,48.41 35.36,48.16 35.36,47.68 35.58,47.45 35.58,46.25 35.46,46.12 35.46,45.94 35.41,45.89 35.41,45.4 35.61,45.2 35.61,45.01 35.38,44.78 35.06,44.78 34.72,44.44 34.72,44.12 34.27,43.67 34.27,43.61 34.09,43.42 34.09,42.94 34.27,42.75 34.27,42.06 34.44,41.89 35.2,41.89 35.56,41.53 v1(35.56,41.4) ; R12.1 31.65,27.66 32.39,26.92 32.64,26.92 33.66,27.94 v1(33.66,30.86)
  Bottom Layer w0.254: v1(35.56,41.4) 34.14,39.98 34.14,31.79 33.66,31.31 v1(33.66,30.86)
CH3: length 59.2
  Top Layer w0.254: 35.43,44.07 36.81,44.07 37.14,44.4 37.14,44.65 v1(36.96,44.83) 36.6,45.19 36.6,49.89 v1(36.51,49.97) 36.83,50.3 U1.31 ; R14.1 70.41,32.89 69.34,32.89 68.65,32.2 66.4,32.2 65.31,31.11 v1(61.6,31.11) ; v1(37.72,32.13) 38.62,32.13 38.84,32.34 46.97,32.34 47.76,31.55 51.64,31.55 v1(51.69,31.5)
  Bottom Layer w0.254: v1(35.31,44.2) 35.31,42.48 36.14,41.64 36.14,41.16 35.31,40.32 35.31,34.54 v1(37.72,32.13) ; v1(61.6,31.11) 61.21,31.5 55.1,31.5 54.85,31.25 54.37,31.25 54.12,31.5 v1(51.69,31.5)
CH4: length 51.2
  Top Layer w0.254: U1.32 37.59,49.8 37.59,49.71 v1(37.18,49.3) ; v1(40.39,64.52) 40.39,65.02 42.14,66.78 42.14,67.61 42.75,68.22 43.59,68.22 44.83,69.47 46.1,69.47 46.1,69.39 v1(46.28,69.22) ; 68.35,71.64 67.44,70.74 v1(66.42,70.74) ; v1(37.18,57.02) 37.18,59.09 38.37,60.27 38.56,60.27 v1(39.37,61.09)
  Bottom Layer w0.254: v1(37.18,49.3) v1(37.18,57.02) ; v1(46.28,69.22) 64.9,69.22 v1(66.42,70.74) ; v1(40.39,64.52) 39.37,63.5 v1(39.37,61.09)
CSN: length 67.5
  Top Layer w0.254: v1(57.53,54.86) 57,55.4 55.65,55.4 55.39,55.14 54.7,55.14 54.47,54.92 53.99,54.92 53.64,55.26 53.64,55.74 53.99,56.08 54.47,56.08 54.7,55.86 55.1,55.86 55.35,56.11 58.01,56.11 58.55,56.65 58.55,57.18 ; v1(40.89,43.43) 40.89,43.94 41.45,44.5 41.45,45.2 41.57,45.31 U1.38
  Bottom Layer w0.254: v1(40.89,43.43) 50.48,43.43 51.07,44.02 51.55,44.02 51.89,43.68 60.48,43.68 62.14,42.02 62.14,40.79 62.5,40.43 62.5,38.39 63.16,37.73 64.09,37.73 64.76,38.39 64.76,42.15 68.83,46.23 68.83,46.48 60.45,54.86 v1(57.53,54.86)
INT: length 21.9
  Top Layer w0.254: U1.45 45.07,47.39 v1(43.05,49.4) ; U5.12 36.7,61.61 v1(36.7,60.83) ; v1(34.92,56.01) 35.18,56.01 v1(37.85,53.34)
  Bottom Layer w0.254: v1(36.7,60.83) 36.83,60.83 36.96,60.96 36.96,58.04 36.88,57.96 36.8,57.96 36.24,57.41 36.24,57.33 v1(34.92,56.01) ; v1(37.85,53.34) 41.78,49.4 v1(43.05,49.4)
IRQ: length 29.5
  Top Layer w0.254: U1.25 46.27,53.3 46.98,54.01 46.98,55.58 46.92,55.64 46.92,56.95 47.55,57.58 47.61,57.58 47.95,57.92 47.95,57.99 v1(48.51,58.55) ; v1(60.83,56.39) 61.09,56.64 61.09,58.15 61.05,58.18
  Bottom Layer w0.254: v1(48.51,58.55) 50.74,58.55 52.72,56.57 53.2,56.57 54.42,57.78 60.07,57.78 60.45,57.4 60.45,56.77 v1(60.83,56.39)
MISO: length 41.1
  Top Layer w0.254: 60.06,57.18 60.06,53.48 60.07,53.47 60.07,53.21 59.89,53.03 v1(58.93,53.03) ; U1.27 43.38,52.3 43.56,52.12 v1(43.56,52.04) ; v1(51.05,51.82) 54.48,51.82 v1(55.37,52.7)
  Bottom Layer w0.254: v1(51.05,51.82) 51.05,51.46 54.94,47.57 55.61,47.57 55.96,47.23 55.96,46.75 55.61,46.41 51.19,46.41 49.2,48.4 49.2,48.88 49.43,49.11 49.43,49.5 48.95,49.99 45.62,49.99 v1(43.56,52.04) ; v1(55.37,52.7) 55.7,53.03 v1(58.93,53.03)
MOSI: length 29.5
  Top Layer w0.254: v1(49.66,54.36) 51.44,54.36 v1(51.69,54.61) ; v1(45.47,51.69) 44.03,51.69 43.8,51.46 40.6,51.46 40.35,51.71 39.65,51.71 U1.28 ; 59.56,57.18 59.56,55.87 58.04,54.36 v1(58.04,52.07)
  Bottom Layer w0.254: v1(58.04,52.07) 54.23,52.07 v1(51.69,54.61) ; v1(49.66,54.36) 49.78,54.36 50.04,54.1 50.04,52.39 50.11,52.31 50.11,51.83 49.77,51.49 49.29,51.49 48.95,51.83 48.95,51.95 48.83,52.07 45.85,52.07 v1(45.47,51.69)
PA1: length 19.9
  Top Layer w0.254: v1(51.69,52.58) 51.31,52.58 51.09,52.8 U1.11 ; C11.1 57.64,46.3 57.58,46.3 57.4,46.48 57.4,46.54 57.26,46.68 57.26,47.17 57.4,47.31 57.4,47.5 56.61,48.29 55.66,48.29 55.56,48.39 v1(55.12,48.39) 53.01,46.28 R4.2 R5.1
  Bottom Layer w0.254: v1(55.12,48.39) 55.12,48.51 51.69,51.94 v1(51.69,52.58)
PA4: length 58.6
  Top Layer w0.254: U1.14 46.07,58.58 v1(45.85,58.8) ; v1(34.16,55.5) 34.16,55.06 35.25,53.97 35.25,53.06 32.73,50.54 31.66,50.54 31.23,50.11 31.23,49.51 31.87,48.87 31.87,47.42 30.43,45.98 30.43,32.82 30.91,32.33 34.22,32.33 36.3,30.26 37.16,30.26 37.77,30.87 38.23,30.87 38.84,30.26 39.46,30.26 40.13,29.59 40.39,29.59 arc(40.85,29.74) 41.3,29.88 R9.1
  Bottom Layer w0.254: v1(34.16,55.5) 34.54,55.12 34.96,55.12 36.6,56.76 36.6,57.27 36.94,57.61 37.45,57.61 38.26,58.42 41.02,58.42 41.27,58.67 45.72,58.67 v1(45.85,58.8)
PB9: length 21.9
  Top Layer w0.254: v1(37.85,54.99) 36.78,54.99 36.6,55.17 36.6,57.62 R20.1 ; U1.46 45.48,46.38 45.48,48.12 42.93,50.67 v1(42.8,50.67)
  Bottom Layer w0.254: v1(42.8,50.67) 39.75,53.72 39.75,57.13 38.38,55.75 37.97,55.75 37.79,55.57 37.85,55.52 v1(37.85,54.99)
PB10: length 17.3
  Top Layer w0.254: R18.1 47.5,66.68 v1(47.5,65.02) ; v1(47.93,60.13) 47.61,59.82 45.59,59.82 44.83,59.06 43.82,59.06 42.57,57.81 U1.21
  Bottom Layer w0.254: v1(47.5,65.02) 46.24,63.77 46.24,61.99 47.93,60.3 v1(47.93,60.13)
PB11: length 32
  Top Layer w0.254: U1.22 42.07,57.11 42.21,57.26 42.21,57.95 43.67,59.41 44.36,59.41 v1(44.74,59.79) ; v1(63.88,55.25) 65.41,55.25 R19.1
  Bottom Layer w0.254: v1(44.74,59.79) 47.45,59.79 47.68,59.55 48.17,59.55 48.41,59.79 51.53,59.79 52.72,58.6 55.45,58.6 56.4,59.55 59.07,59.55 63.37,55.25 v1(63.88,55.25)
RESET: length 24.1
  Top Layer w0.254: v1(57.85,46.92) 58.42,47.5 v1(59.05,47.5) ; v1(63.37,48.51) 63.37,46.65 C10.2 ; 56.16,46.2 v1(55.37,46.99) ; 56.16,46.2 56.49,45.88 R3.1 ; 56.16,46.2 56.16,46.64 v1(56.64,47.12) ; U1.7 48.07,50.8 v1(50.29,50.8)
  Bottom Layer w0.254: v1(55.37,46.99) 53.09,46.99 50.8,49.28 50.8,49.72 50.88,49.8 50.88,50.28 50.53,50.62 50.47,50.62 v1(50.29,50.8) ; v1(57.85,46.92) 57.53,46.61 56.64,46.61 56.52,46.74 56.64,46.86 v1(56.64,47.12) ; v1(63.37,48.51) 60.07,48.51 v1(59.05,47.5)
SCK: length 23.5
  Top Layer w0.254: v1(48.89,56.64) 48.89,56.26 49.02,56.13 47.33,54.45 47.33,53.86 46.27,52.8 U1.26 ; 59.05,57.18 59.05,56.52 58.29,55.75 55.5,55.75 55.24,55.5 v1(54.23,55.5)
  Bottom Layer w0.254: v1(54.23,55.5) 50.04,55.5 v1(48.89,56.64)
SCL: length 43.5
  Top Layer w0.254: v1(41.66,50.42) 42.47,49.61 42.47,48.14 43.57,47.05 U1.42 ; v1(38.75,69.65) 38.75,68.63 R7.1 36.91,66.79 35.24,66.79 34.56,66.11 U5.23 ; v1(39.01,54.74) 38.79,54.97 38.79,58.36 38.51,58.64 v1(38.51,59.41) ; v1(45.97,61.09) 45.63,60.75 U6.4 ; v1(42.04,64.64) 42.04,65.41 42.67,66.04
  Bottom Layer w0.254: v1(39.01,54.74) 39.39,54.36 39.39,53.57 41.66,51.31 v1(41.66,50.42) ; v1(38.51,59.41) 39.61,60.5 39.96,60.5 40.72,61.26 40.72,61.61 40.89,61.79 42.04,61.79 42.04,62.8 41.96,62.88 41.96,63.36 42.04,63.44 v1(42.04,64.64) 41.78,64.9 42.16,64.9 v1(45.97,61.09) ; v1(38.75,69.65) 39.07,69.65 v1(42.62,66.09)
SDA: length 43
  Top Layer w0.254: v1(39.62,66.06) 39.62,64.45 40.14,63.93 40.63,63.93 40.97,64.27 41.39,64.27 v1(42.55,63.12) ; v1(40.39,54.74) 40.13,54.99 40.13,58.16 v1(39.24,59.05) ; v1(46.48,60.45) 47.12,60.45 47.24,60.33 47.24,60.45 47.37,60.58 47.37,60.83 46.51,61.69 45.71,61.69 45.59,61.57 45.35,61.57 U6.3 ; v1(43.69,47.75) 44.07,47.38 U1.43 ; v1(36.95,68.5) 36.88,68.5 36.37,67.98 36.37,67.93 R8.1 35.58,67.14 35.09,67.14 34.06,66.11 U5.24
  Bottom Layer w0.254: v1(40.39,54.74) 42.98,52.15 42.98,51.8 43.69,51.09 v1(43.69,47.75) ; v1(39.62,66.06) 39.35,66.06 39.24,66.17 39.24,66.21 v1(36.95,68.5) ; 46.36,60.2 45.47,60.2 v1(42.55,63.12) 42.42,62.99 42.42,62.36 42.39,62.34 42.39,61.64 42.18,61.43 41.49,61.43 39.24,59.18 v1(39.24,59.05)
SWCLK(PA14): length 41.9
  Top Layer w0.254: v1(62.61,31.88) 63.39,32.65 64.59,32.65 64.76,32.82 64.76,34.02 67.06,36.32 H1.2 ; v1(44.2,40.77) 43.87,41.1 43.87,42.24 43.69,42.42 43.25,42.42 43.24,42.43 41.01,42.43 41,42.42 40.39,42.42 39.75,43.05 39.75,43.31 41.07,44.62 U1.37 ; v1(61.6,33.02) 61.15,33.46 v1(61.15,36.26)
  Bottom Layer w0.254: v1(61.15,36.26) 61.36,36.05 61.36,35.84 61.21,35.69 49.28,35.69 v1(44.2,40.77) ; v1(61.6,33.02) 62.61,32 v1(62.61,31.88)
SWDIO(PA13): length 65.7
  Top Layer w0.254: v1(34.04,44.32) 34.66,44.95 v1(34.66,46.85) ; v1(35.94,47.92) 35.94,46.1 35.81,45.97 35.81,45.83 v1(35.99,45.65) ; v1(35.43,33.27) 36.58,34.42 v1(36.58,34.67) ; v1(37.26,46.81) 37.21,46.86 36.96,46.86 37.21,47.12 37.21,47.88 37.08,48.01 36.96,48.01 37.16,48.21 37.16,48.46 37.34,48.64 38.71,48.64 38.78,48.71 39.48,48.71 U1.34 ; v1(34.54,30.99) 33.78,31.75 v1(33.27,31.75)
  Bottom Layer w0.254: v1(34.04,44.32) 34.04,40.38 33.78,40.13 33.78,32.26 v1(33.27,31.75) ; v1(37.26,46.81) 36.58,47.5 35.94,47.5 35.89,47.55 35.89,47.87 v1(35.94,47.92) ; v1(35.43,33.27) 35.43,31.88 v1(34.54,30.99) ; v1(34.66,46.85) 35.87,45.65 v1(35.99,45.65) ; H1.3 64.76,36.31 64.76,35.85 64.09,35.19 37.67,35.19 37.15,34.67 v1(36.58,34.67)
UART2_RX: length 33.3
  Top Layer w0.254: v1(47.37,58.17) 47.55,58.35 47.55,58.8 47.37,58.98 46.74,58.98 46.57,58.8 U1.13
  Bottom Layer w0.254: H2.3 64.01,39.24 64.01,39.93 63.67,40.27 63.16,40.27 62.5,40.93 62.5,41.87 62.88,42.25 62.88,42.59 60.48,44.99 60.48,45.12 55.8,49.8 55.68,49.8 50.33,55.14 49.57,55.14 48.31,56.4 48.31,56.84 47.88,57.28 47.88,57.47 47.8,57.54 47.8,57.73 v1(47.37,58.17)
UART2_TX: length 23.3
  Top Layer w0.254: U1.12 48.32,53.55 55.54,53.55 59.46,49.63 59.46,49.18 59.62,49.01 60.08,49.01 61.34,47.75 v1(61.34,46.99)
  Bottom Layer w0.254: H2.4 63.63,44.7 v1(61.34,46.99)
$1N5880: length 4.5
  Top Layer w0.254: R14.2 R15.2 70.97,29.51 72.3,28.18
$1N5885: length 3.8
  Top Layer w0.254: R13.2 R12.2 29.5,27.77 Q2.1
$1N5890: length 3.7
  Top Layer w0.254: R10.2 R11.2 28.05,73.4 Q1.1
$1N5900: length 2.8
  Top Layer w0.254: R6.1 66.42,46.39 65.29,47.52 LED6.2
$1N5903: length 22.7
  Top Layer w0.254: C7.2 62.49,45.55 U2.2 61.35,51.44 v1(59.18,51.44) ; v1(57.28,49.15) 56.77,48.64 55.8,48.64 55.48,48.97 54.88,48.97 53.66,47.75 51.69,47.75 49.14,50.3 U1.6
  Bottom Layer w0.254: v1(59.18,51.44) 59.18,51.05 v1(57.28,49.15)
$1N5904: length 17
  Top Layer w0.254: v1(49.78,48.64) 49.09,49.33 49.09,49.47 48.85,49.71 48.72,49.71 48.63,49.8 U1.5 ; v1(50.29,50.04) 53.33,50.04 U2.1 57.28,50.29 60.44,47.13 C1.2
  Bottom Layer w0.254: v1(50.29,50.04) 49.78,49.53 v1(49.78,48.64)
$1N5960: length 5.3
  Top Layer w0.254: Q1.3 25.01,75.7 24.73,75.97 ; 24.57,76.13 24.73,75.97 ; 24.73,75.97 D2.2
$1N5961: length 10.3
  Top Layer w0.254: D4.2 71.98,27.4 72.12,27.26 72.73,27.26 Q3.3 74.61,29.12 74.61,25.81 74.51,25.7 74.51,25.47 74.61,25.37 CN4.2
$1N5962: length 8.2
  Top Layer w0.254: 29.64,25.48 27.08,28.04 D3.2 25.62,26.25 CN3.2
$1N5973: length 1.8
  Top Layer w0.254: LED2.2 39.46,31.11 R9.2
$1N5974: length 2.4
  Top Layer w0.254: LED3.2 46.49,67.18 R18.2
$1N5975: length 2.1
  Top Layer w0.254: R19.2 68.32,52.44 LED4.2
$1N5976: length 1.9
  Top Layer w0.254: R20.2 35.06,57.66 LED5.2
$1N6000: length 26.1
  Top Layer w0.508: C9.2 C8.2 41.97,38.61 U3.4 U3.5 38.84,38.89 38.84,39.32 37.82,40.33 35.9,40.33 35.31,39.74 L1.1 30.99,41.39 30.99,45.72 32.36,47.09 32.36,48.84 33.28,49.76 33.42,49.76 SW1.2
$1N6034: length 6.6
  Top Layer w0.254: D5.2 73.67,70.39 Q4.3 76.39,73.11 76.39,75.38
$1N6037: length 6.8
  Top Layer w0.254: Q4.1 73.43,74.51 72.28,73.35 72.28,73.24 R17.2 69.61,70.58 R16.2

## Copper pours and planes (outline as drawn; the poured copper is in the pictures)
GND on Top Layer: -17.02,112.65 117.22,112.65 117.22,-15.24 -17.02,-15.24
GND on Bottom Layer: -20.57,123.44 148.08,123.44 148.08,-30.35 -20.57,-30.35

## Text on the board
Top Silkscreen Layer: + | T | R | G | 3V3 | DIO | CLK
